# EAGLE design RoverWingPogoTester-V1 (EAGLE 9.5.2)
Assembly variants: LCSC, DIGIKEY
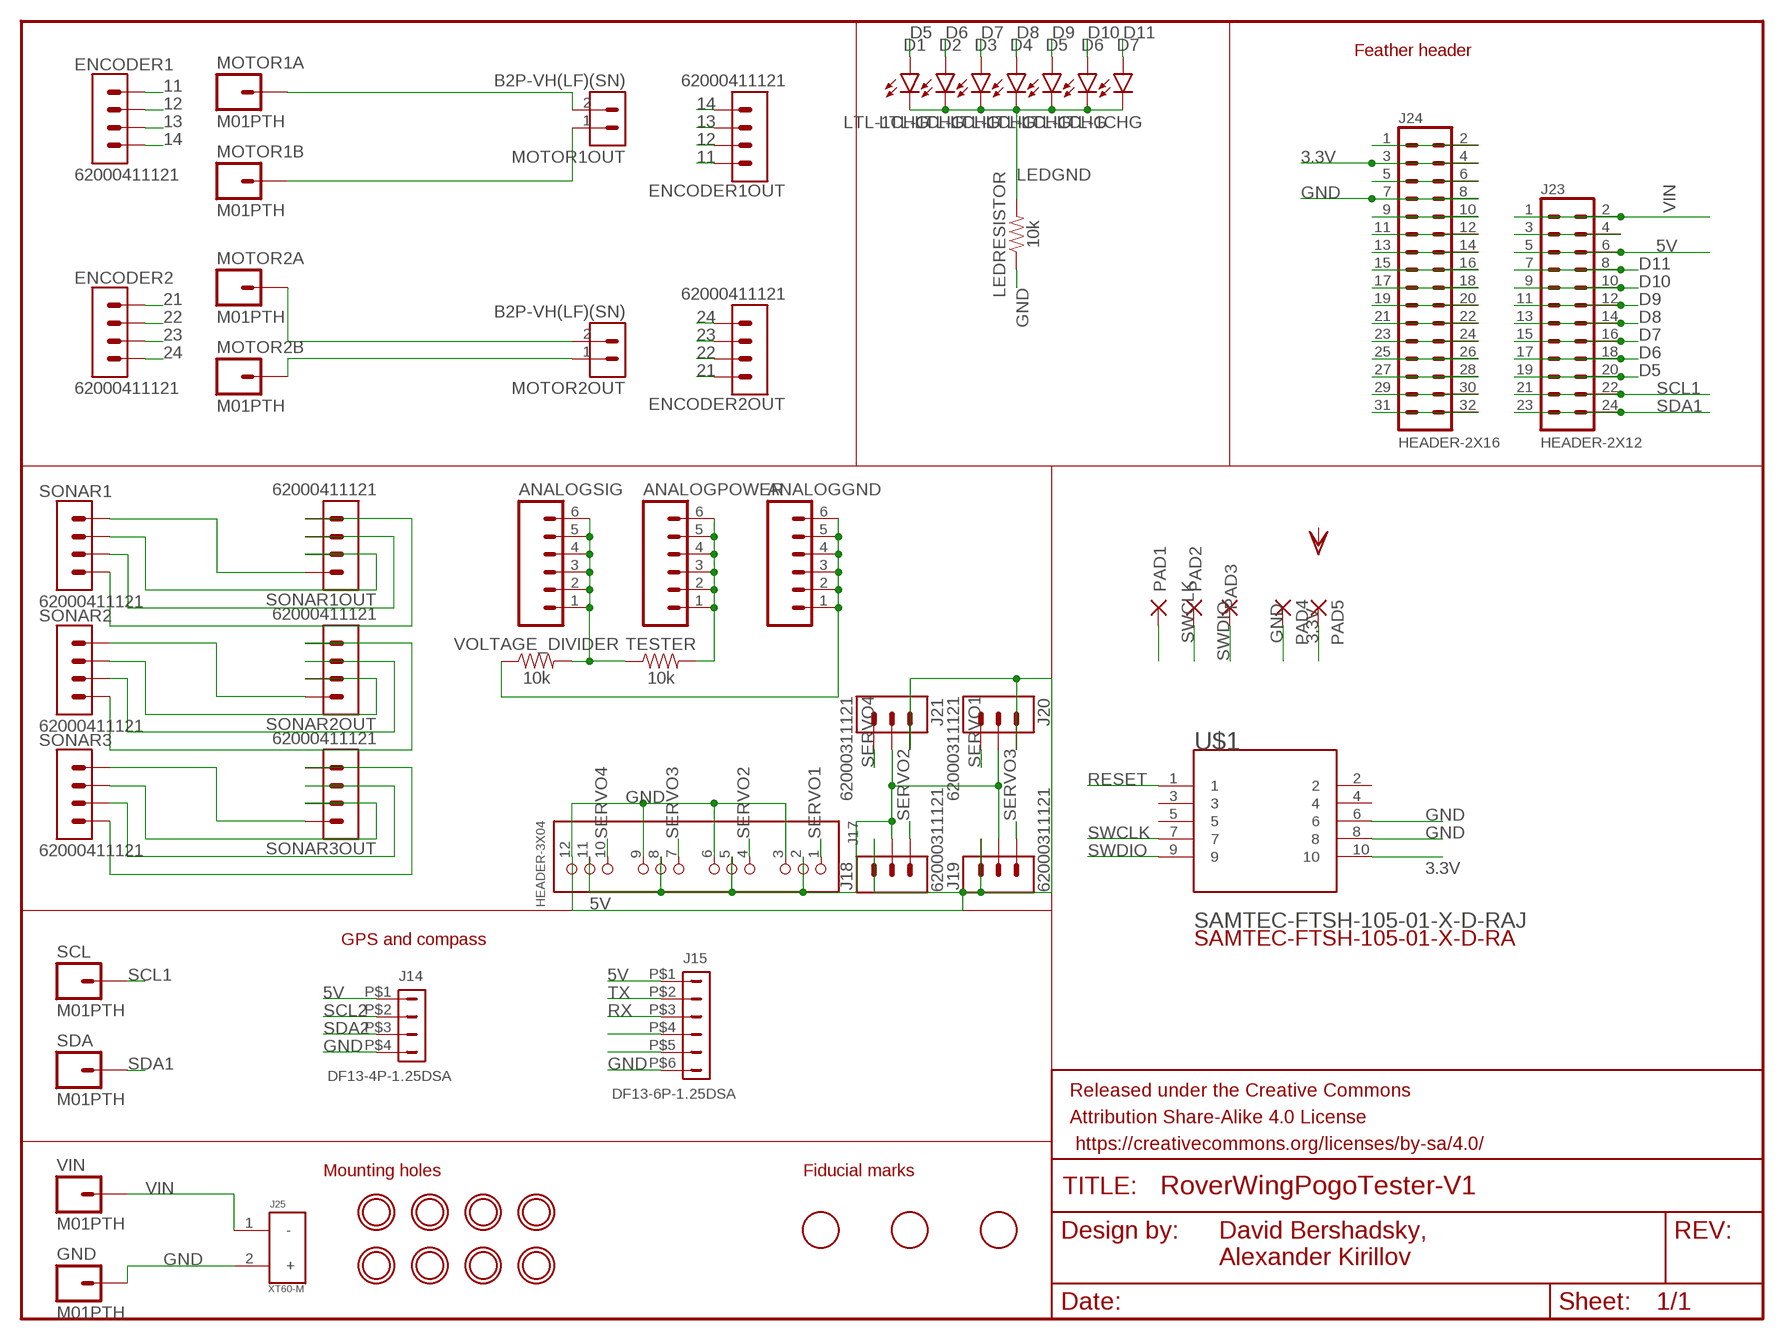
[diagram p0: schematic, sheet 1]

## Parts
ANALOGGND  M06SIP  [1X06]
ANALOGPOWER  M06SIP  [1X06]
ANALOGSIG  M06SIP  [1X06]
D1  LTL-1CHG  [RADIAL_3MM]
D2  LTL-1CHG  [RADIAL_3MM]
D3  LTL-1CHG  [RADIAL_3MM]
D4  LTL-1CHG  [RADIAL_3MM]
D5  LTL-1CHG  [RADIAL_3MM]
D6  LTL-1CHG  [RADIAL_3MM]
D7  LTL-1CHG  [RADIAL_3MM]
ENCODER1  62000411121  [62000411121]
ENCODER1OUT  62000411121  [62000411121]
ENCODER2  62000411121  [62000411121]
ENCODER2OUT  62000411121  [62000411121]
FRAME3  FRAME-LETTERNO_PACKAGE  [DUMMY]
GND  M01PTH  [1X01]
J14  DF13-4P-1.25DSA  [DF13-4P-1.25DSA]
J15  DF13-6P-1.25DSA  [DF13-6P-1.25DSA]
J17  HEADER-3X04  [3X04]
J18  62000311121  [62000311121]
J19  62000311121  [62000311121]
J20  62000311121  [62000311121]
J21  62000311121  [62000311121]
J23  HEADER-2X12  [2X12]
J24  HEADER-2X16  [2X16]
J25  XT60-M  [AMASS_XT60-M]
LEDRESISTOR  10k  10KOHM-HORIZ-1/4W-1%  [AXIAL-0.3]
MOTOR1A  M01PTH  [1X01]
MOTOR1B  M01PTH  [1X01]
MOTOR1OUT  B2P-VH(LF)(SN)  [HDR-02]
MOTOR2A  M01PTH  [1X01]
MOTOR2B  M01PTH  [1X01]
MOTOR2OUT  B2P-VH(LF)(SN)  [HDR-02]
PAD1  2,15/1,0  [2,15/1,0]
PAD2  2,15/1,0  [2,15/1,0]
PAD3  2,15/1,0  [2,15/1,0]
PAD4  2,15/1,0  [2,15/1,0]
PAD5  2,15/1,0  [2,15/1,0]
SCL  M01PTH  [1X01]
SDA  M01PTH  [1X01]
SONAR1  62000411121  [62000411121]
SONAR1OUT  62000411121  [62000411121]
SONAR2  62000411121  [62000411121]
SONAR2OUT  62000411121  [62000411121]
SONAR3  62000411121  [62000411121]
SONAR3OUT  62000411121  [62000411121]
TESTER  10k  10KOHM-HORIZ-1/4W-1%  [AXIAL-0.3]
U$1  SAMTEC-FTSH-105-01-X-D-RAJ  [SAMTEC-FTSH-105-01-X-D-RA]
U$3  MOUNTINGHOLE3.0_NPH  [MOUNTINGHOLE_3.0_NPH]
U$4  MOUNTINGHOLE3.0_NPH  [MOUNTINGHOLE_3.0_NPH]
U$11  FIDUCIAL  [FIDUCIAL_1MM]
U$13  FIDUCIAL  [FIDUCIAL_1MM]
U$14  MOUNTINGHOLE3.0_NPH  [MOUNTINGHOLE_3.0_NPH]
U$15  MOUNTINGHOLE3.0_NPH  [MOUNTINGHOLE_3.0_NPH]
U$17  FIDUCIAL  [FIDUCIAL_1MM]
U$24  MOUNTINGHOLE3.0_NPH  [MOUNTINGHOLE_3.0_NPH]
U$25  MOUNTINGHOLE3.0_NPH  [MOUNTINGHOLE_3.0_NPH]
U$26  MOUNTINGHOLE3.0_NPH  [MOUNTINGHOLE_3.0_NPH]
U$27  MOUNTINGHOLE3.0_NPH  [MOUNTINGHOLE_3.0_NPH]
VIN  M01PTH  [1X01]
VOLTAGE_DIVIDER  10k  10KOHM-HORIZ-1/4W-1%  [AXIAL-0.3]

## Nets
3.3V: J24.3 J24.4 PAD5.1(P) U$1.10
5V: J14.P$1 J15.P$1 J17.2 J17.5 J17.8 J17.11 J18.2 J19.2 J20.2 J21.2 J23.5 J23.6
11: ENCODER1.1 ENCODER1OUT.1
12: ENCODER1.2 ENCODER1OUT.2
13: ENCODER1.3 ENCODER1OUT.3
14: ENCODER1.4 ENCODER1OUT.4
21: ENCODER2.1 ENCODER2OUT.1
22: ENCODER2.2 ENCODER2OUT.2
23: ENCODER2.3 ENCODER2OUT.3
24: ENCODER2.4 ENCODER2OUT.4
!RESET1: J24.1 J24.2
D5: D1.A J23.19 J23.20
D6: D2.A J23.17 J23.18
D7: D3.A J23.15 J23.16
D8: D4.A J23.13 J23.14
D9: D5.A J23.11 J23.12
D10: D6.A J23.9 J23.10
D11: D7.A J23.7 J23.8
GND: GND.1 J14.P$4 J15.P$6 J17.3 J17.6 J17.9 J17.12 J18.1 J19.1 J20.1 J21.1 J24.7 J24.8 J25.2(+) LEDRESISTOR.P$1 PAD4.1(P) U$1.6 U$1.8
LEDGND: D1.C D2.C D3.C D4.C D5.C D6.C D7.C LEDRESISTOR.P$2
N$1: MOTOR1A.1 MOTOR1OUT.2
N$2: MOTOR1B.1 MOTOR1OUT.1
N$3: MOTOR2A.1 MOTOR2OUT.2
N$4: MOTOR2B.1 MOTOR2OUT.1
N$5: SONAR1.4 SONAR1OUT.4
N$6: SONAR1.3 SONAR1OUT.3
N$7: SONAR1.2 SONAR1OUT.2
N$8: ANALOGPOWER.1 ANALOGPOWER.2 ANALOGPOWER.3 ANALOGPOWER.4 ANALOGPOWER.5 ANALOGPOWER.6 TESTER.P$2
N$9: SONAR1.1 SONAR1OUT.1
N$10: SONAR2.4 SONAR2OUT.4
N$11: SONAR2.3 SONAR2OUT.3
N$12: SONAR2.2 SONAR2OUT.2
N$13: SONAR2.1 SONAR2OUT.1
N$14: SONAR3.4 SONAR3OUT.4
N$15: SONAR3.3 SONAR3OUT.3
N$16: SONAR3.2 SONAR3OUT.2
N$17: SONAR3.1 SONAR3OUT.1
N$18: ANALOGSIG.1 ANALOGSIG.2 ANALOGSIG.3 ANALOGSIG.4 ANALOGSIG.5 ANALOGSIG.6 TESTER.P$1 VOLTAGE_DIVIDER.P$2
N$23: ANALOGGND.1 ANALOGGND.2 ANALOGGND.3 ANALOGGND.4 ANALOGGND.5 ANALOGGND.6 VOLTAGE_DIVIDER.P$1
N$24: J23.3 J23.4
N$26: J15.P$4
N$27: J15.P$5
N$34: J24.5 J24.6
N$35: J24.9 J24.10
N$36: J24.11 J24.12
N$37: J24.13 J24.14
N$38: J24.15 J24.16
N$39: J24.17 J24.18
N$47: J24.19 J24.20
N$60: J24.21 J24.22
N$61: J24.23 J24.24
N$62: J24.25 J24.26
N$63: J24.27 J24.28
N$64: J24.29 J24.30
N$65: J24.31 J24.32
RESET: PAD1.1(P) U$1.1
RX: J15.P$3
SCL1: J23.21 J23.22 SCL.1
SCL2: J14.P$2
SDA1: J23.23 J23.24 SDA.1
SDA2: J14.P$3
SERVO1: J17.1 J20.3
SERVO2: J17.4 J18.3
SERVO3: J17.7 J19.3
SERVO4: J17.10 J21.3
SWCLK: PAD2.1(P) U$1.7
SWDIO: PAD3.1(P) U$1.9
TX: J15.P$2
VIN: J23.1 J23.2 J25.1(-) VIN.1
Unconnected: U$1.2 U$1.3 U$1.4 U$1.5

## Notes on the sheet
- Feather header
- GPS and compass
- Mounting holes | Fiducial marks
- David Bershadsky, 
  Alexander Kirillov

## Library data of the parts
ANALOGGND ANALOGPOWER ANALOGSIG = SparkFun:M06: Header 6 Standard 6-pin 0.1" header. Use with straight break away headers (SKU : PRT-00116), right angle break away headers (PRT-00553), swiss pins (PRT-00743), machine pins (PRT-00117), and female headers (PRT-00115). Molex polarized connector foot print use with SKU : PRT-08094 with associated crimp pins and housings. NOTES ON THE VARIANTS LOCK and LOCK_LONGPADS... This footprint was designed to help hold the alignment of a through-hole component (i.e. 6-pin header) while soldering it into place. You may notice that each hole has been shifted either up or down by 0.005 of an inch from it's more standard position (which is a perfectly straight line). This slight alteration caused the pins (the squares in the middle) to touch the edges of the holes. Because they are alternating, it causes a "brace" to hold the component in place. 0.005 has proven to be the perfect amount of "off-center" position when using our standard breakaway headers. Although looks a little odd when you look at the bare footprint, once you have a header in there, the alteration is very hard to notice. Also, if you push a header all the way into place, it is covered up entirely on the bottom side. This idea of altering the position of holes to aid alignment will be further integrated into the Sparkfun Library for other footprints. It can help hold any component with 3 or more connection pins.
D1-D7 = LED:LTL-1CHG: LED RED DIFFUSED T/H Manufacturer's datasheet <https://media.digikey.com/pdf/Data%20Sheets/Lite-On%20PDFs/LTL-1CHG.pdf>; CREATED_BY: PCBLayout.com; DIGIKEY_PART_NUMBER: 160-1710-ND; MANUFACTURER: Lite-On Inc.; MPN: LTL-1CHG; PACKAGE: RADIAL 3MM
ENCODER1 ENCODER1OUT ENCODER2 ENCODER2OUT SONAR1 SONAR1OUT SONAR2 SONAR2OUT SONAR3 SONAR3OUT = Headers:62000411121: THT Vertical Pin Header WR-PHD, Pitch 2.00 mm, Single Row, 4 pins Manufacturer's datasheet <https://datasheet.octopart.com/62000411121-W%C3%BCrth-Elektronik-datasheet-117282003.pdf>; CREATED_BY: PCBLayout.com; MANUFACTURER: Würth Elektronik; MPN: 62000411121
FRAME3 = RoverWing-V1.5:FRAME-LETTER: Schematic Frame - Letter Standard 8.5x11 US Letter frame; BOM: EXCLUDE
GND MOTOR1A MOTOR1B MOTOR2A MOTOR2B SCL SDA VIN = SparkFun:M01: Header 1 Standard 1-pin 0.1" header. Use with straight break away headers (SKU : PRT-00116), right angle break away headers (PRT-00553), swiss pins (PRT-00743), machine pins (PRT-00117), and female headers (PRT-00115).
J14 = RoverWing-V1.5:DF13-4P-1.25: DF13-4P 1.25mm Pitch Miniature Crimping Connector.; MANUFACTURER: Hirose; PARTNO: DF13-4P-1.25DSA
J15 = RoverWing-V1.5:DF13-6P-1.25: DF13-6P 1.25mm Pitch Miniature Crimping Connector.; MANUFACTURER: Hirose; PARTNO: DF13-6P-1.25DSA
J17 = RoverWing-V1.5:HEADER-3X04
J18-J21 = Headers:62000311121: THT Vertical Pin Header WR-PHD, Pitch 2.00 mm, Single Row, 3 pins Manufacturer's datasheet <https://datasheet.octopart.com/62000311121-W%C3%BCrth-Elektronik-datasheet-117282002.pdf>; CREATED_BY: PCBLayout.com; MANUFACTURER: Würth Elektronik; MPN: 62000311121
J23 = RoverWing-V1.5:HEADER-2X12: HEADER, 2x12, 0.1" PITCH; MANUFACTURER: CONNFLY Elec; PARTNO: DS1023-2*12SF11
J24 = RoverWing-V1.5:HEADER-2X16: HEADER - 2x16, 0.1" PITCH; MANUFACTURER: CONNFLY Elec; PARTNO: DS1023-2*16SF11
J25 = XT60-M:XT60-M: DC supply; XT60; male; PIN:2; for cable; soldered; 60A; 500V; AVAILABILITY: Unavailable; MF: AMASS; MP: XT60-M; PACKAGE: Package Analog Devices; PRICE: None
LEDRESISTOR TESTER VOLTAGE_DIVIDER = SparkFun-Resistors:10KOHM: 10kΩ resistor A resistor is a passive two-terminal electrical component that implements electrical resistance as a circuit element. Resistors act to reduce current flow, and, at the same time, act to lower voltage levels within circuits. - Wikipedia; PROD_ID: RES-12183
MOTOR1OUT MOTOR2OUT = Connectors:B2P-VH(LF)(SN): CONN HEADER VERT 2POS 3.96MM Manufacturer's datasheet <http://www.jst-mfg.com/product/pdf/eng/eVH.pdf>; CREATED_BY: PCBLayout.com; DIGIKEY_PART_NUMBER: 455-1639-ND; MANUFACTURER: JST Sales America Inc.; MPN: B2P-VH(LF)(SN)
PAD1-PAD5 = wirepad:2,15/1,0: THROUGH-HOLE PAD
U$1 = SAMTEC-FTSH-105-01-X-D-RA:SAMTEC-FTSH-105-01-X-D-RA; DESCRIPTION: Conn Unshrouded Header HDR 10 POS 1.27mm Solder RA Thru-Hole Tube; DIGI-KEY_PART_NUMBER: SAM9432-ND; DIGI-KEY_PURCHASE_URL: https://www.digikey.com/product-detail/en/samtec-inc/FTSH-105-01-F-D-RA-K/SAM9432-ND/6678169?utm_source=snapeda&utm_medium=aggregator&utm_campaign=symbol; MF: Samtec Inc.; MP: FTSH-105-01-F-D-RA-K; PACKAGE: None
U$3 U$4 U$14 U$15 U$24-U$27 = RoverWing-V1.5:MOUNTINGHOLE: Mounting Hole For #2 screws (0.086"/2.18mm width, 0.094"/2.4mm hole) use 2.5mm; BOM: EXCLUDE
U$11 U$13 U$17 = RoverWing-V1.5:FIDUCIAL: For use by pick and place machines to calibrate the vision/machine, 1mm By microbuilder.eu; BOM: EXCLUDE

## Net classes
1 thinpower: width 0.305 mm
2 thickpower: width 0.406 mm

## Board
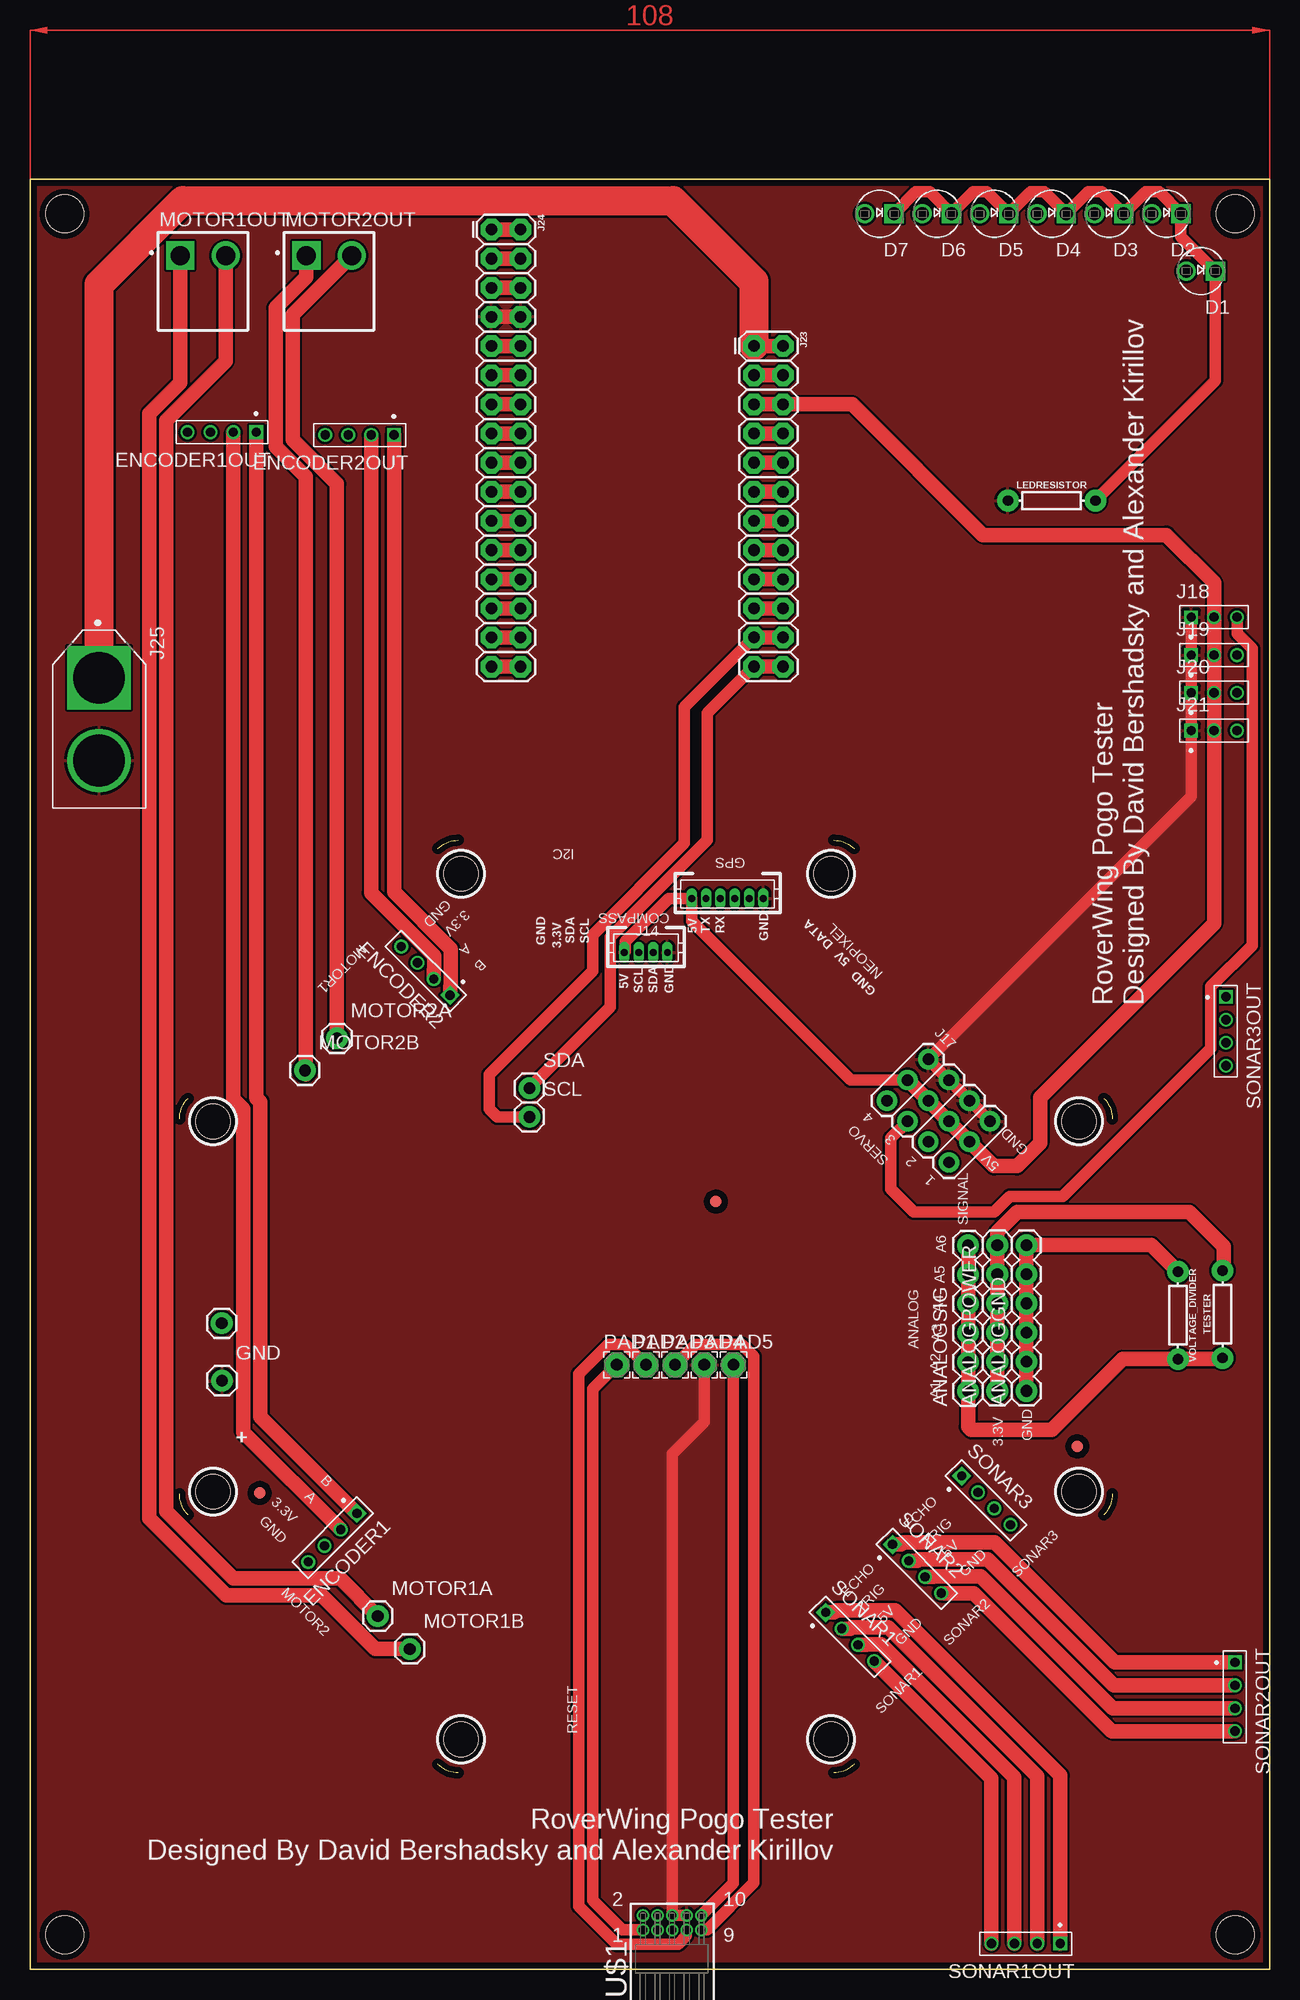
[diagram p1: board, top side]
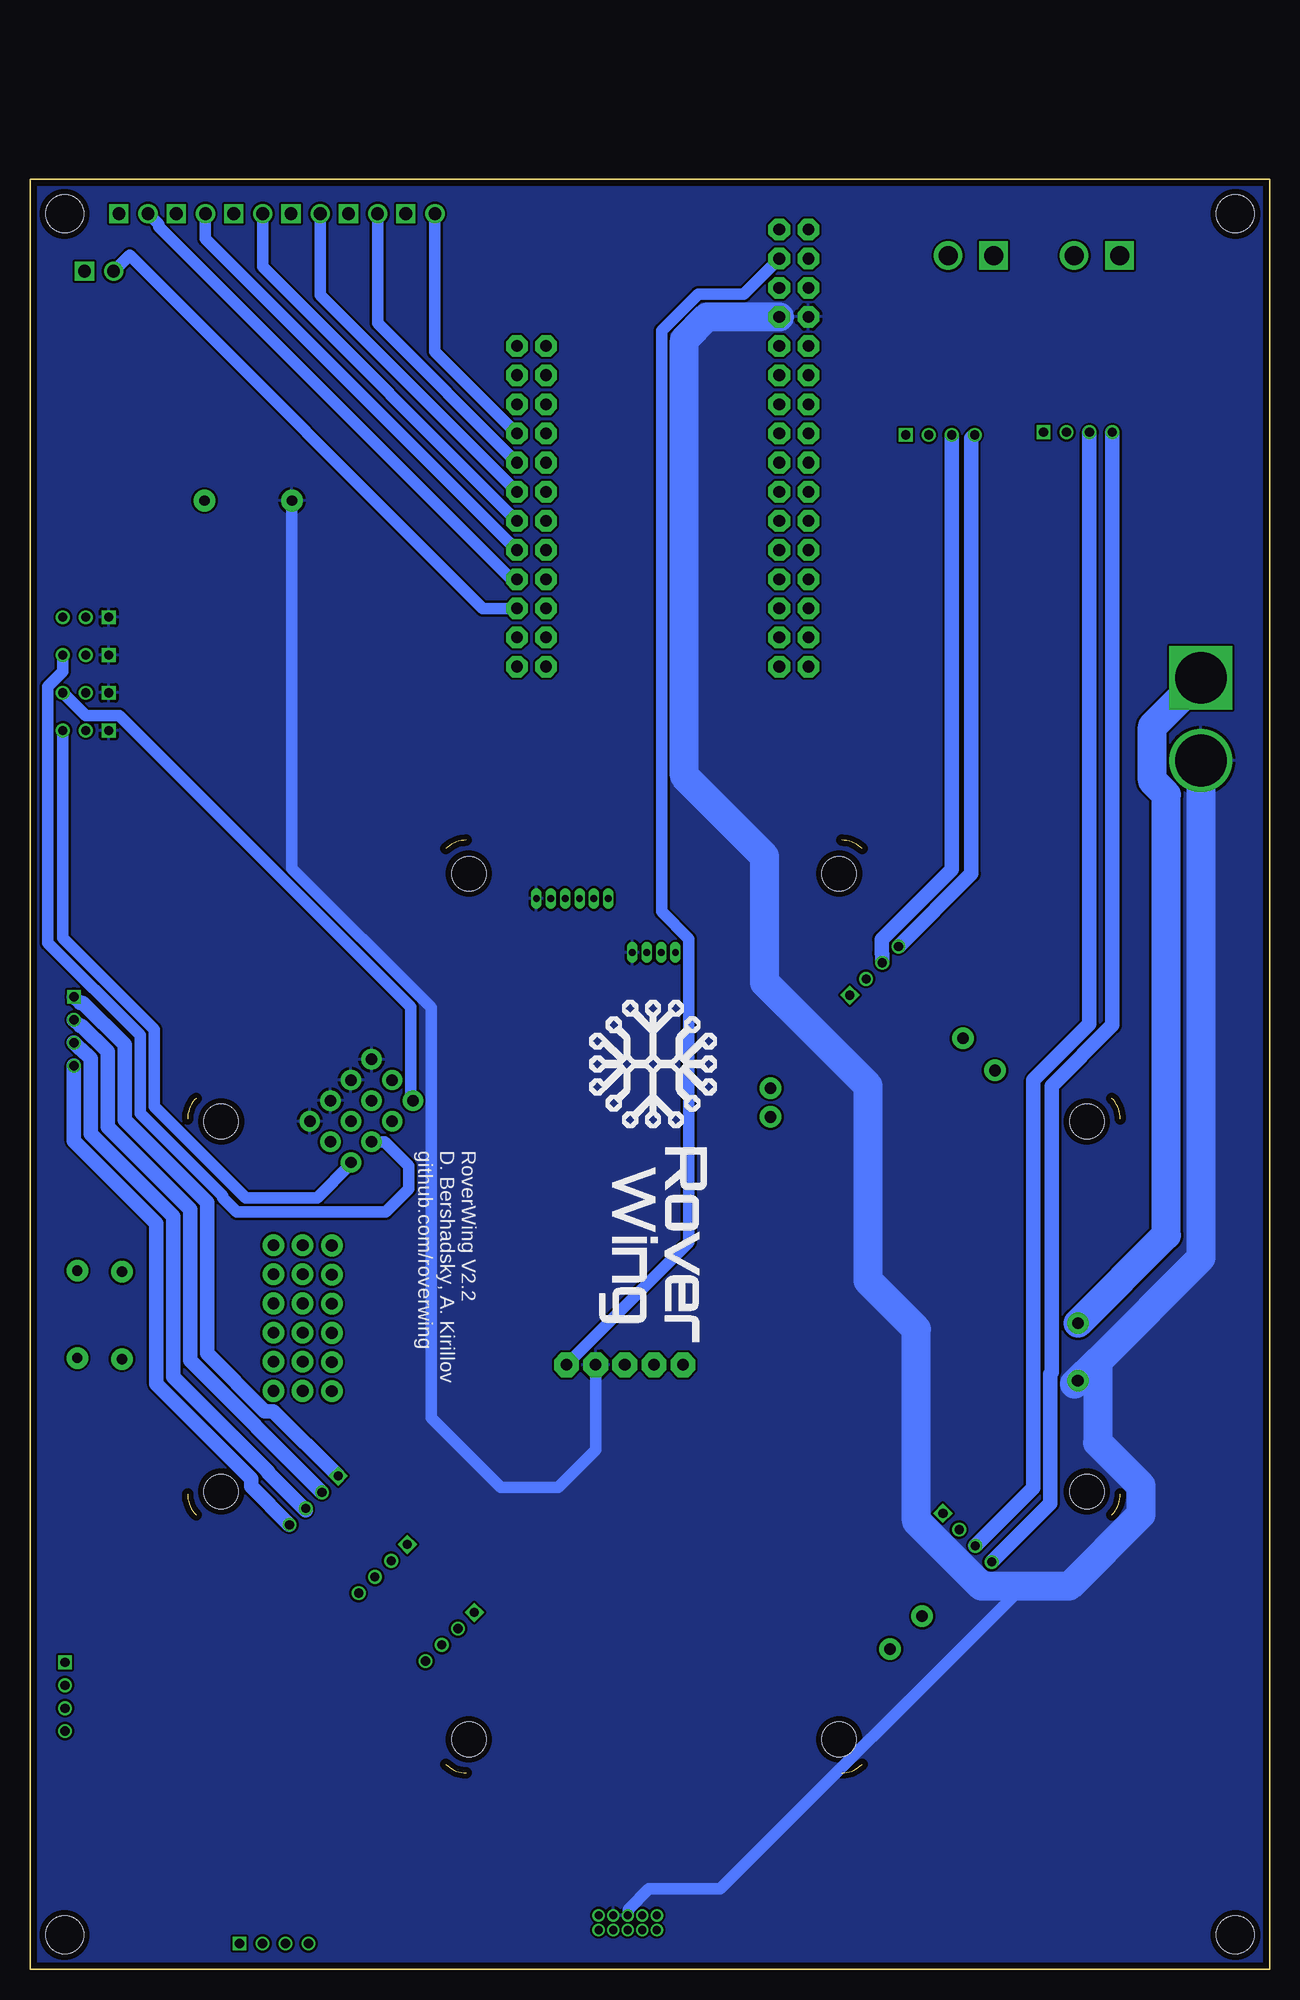
[diagram p2: board, bottom side, seen from below]

Size 108 x 156 mm. Coordinates in mm from the lower left corner, seen from the top.
Outline: 13.01,74.11 arc-45 13.76,75.91
Outline: 35.51,97.66 arc-45 37.3,98.41
Outline: 70,98.41 arc-45 71.79,97.66
Outline: 93.55,75.91 arc-45 94.29,74.11
Outline: 94.29,41.42 arc-45 93.55,39.62
Outline: 71.79,17.87 arc-45 70,17.12
Outline: 37.3,17.12 arc-45 35.51,17.87
Outline: 13.76,39.62 arc-45 13.01,41.42
Outline: 0,156 108,156 108,0 0,0 0,156
Copper layers (1*16): Top 0.035mm / dielectric 1.6mm / Bottom 0.035mm
Design rules "Elecrow_2-layer_PCB_eagle_rule *": minimum track width 6mil, minimum drill 12mil, track to track 8mil, track to pad 8mil, pad to pad 8mil, via to via 8mil, smd to smd 0mil, copper to edge 20mil, drill to drill 10mil, minimum pad ring 6mil, minimum via ring 6mil, stop-mask expansion 0mil, vias tented up to drill 100mil, thermal gap 10mil
Holes 3.3 mm at 3,153 3,3 105,3 105,153

### Footprints (pad centres in the part's own frame; a part is rotated, then mirrored left to right if it is on the bottom)
1X06 = drill 1.016 pad 1.88: 1 0,0; 2 2.54,0; 3 5.08,0; 4 7.62,0; 5 10.16,0; 6 12.7,0
RADIAL_3MM = drill 1.11 pad 1.67: A 1.27,0 | drill 1.11 pad 1.67 square: C -1.27,0
62000411121 = drill 0.8 square: 1 -3,0 | drill 0.8: 2 -1,0; 3 1,0; 4 3,0
1X01 = drill 1.016 pad 1.88: 1 0,0
DF13-4P-1.25DSA = drill 0.6 pad 0.8 long: P$1 1.875,0; P$2 0.625,0; P$3 -0.625,0; P$4 -1.875,0
DF13-6P-1.25DSA = drill 0.6 pad 0.9 long: P$1 3.125,0; P$2 1.875,0; P$3 0.625,0; P$4 -0.625,0; P$5 -1.875,0; P$6 -3.125,0
3X04 = drill 1 pad 1.778: 1 -3.81,-2.54; 2 -3.81,0; 3 -3.81,2.54; 4 -1.27,-2.54; 5 -1.27,0; 6 -1.27,2.54; 7 1.27,-2.54; 8 1.27,0; 9 1.27,2.54; 10 3.81,-2.54; 11 3.81,0; 12 3.81,2.54
62000311121 = drill 0.8 square: 1 -2,0 | drill 0.8: 2 0,0; 3 2,0
2X12 = drill 1.016 pad 1.88 octagon: 1 0,0; 2 0,2.54; 3 2.54,0; 4 2.54,2.54; 5 5.08,0; 6 5.08,2.54; 7 7.62,0; 8 7.62,2.54; 9 10.16,0; 10 10.16,2.54; 11 12.7,0; 12 12.7,2.54; 13 15.24,0; 14 15.24,2.54; 15 17.78,0; 16 17.78,2.54; 17 20.32,0; 18 20.32,2.54; 19 22.86,0; 20 22.86,2.54; 21 25.4,0; 22 25.4,2.54; 23 27.94,0; 24 27.94,2.54
2X16 = drill 1.016 pad 1.88 octagon: 1 0,0; 2 0,2.54; 3 2.54,0; 4 2.54,2.54; 5 5.08,0; 6 5.08,2.54; 7 7.62,0; 8 7.62,2.54; 9 10.16,0; 10 10.16,2.54; 11 12.7,0; 12 12.7,2.54; 13 15.24,0; 14 15.24,2.54; 15 17.78,0; 16 17.78,2.54; 17 20.32,0; 18 20.32,2.54; 19 22.86,0; 20 22.86,2.54; 21 25.4,0; 22 25.4,2.54; 23 27.94,0; 24 27.94,2.54; 25 30.48,0; 26 30.48,2.54; 27 33.02,0; 28 33.02,2.54; 29 35.56,0; 30 35.56,2.54; 31 38.1,0; 32 38.1,2.54
AMASS_XT60-M = drill 4.5 square: 1 -3.6,0 | drill 4.5: 2 3.6,0
AXIAL-0.3 = drill 0.9 pad 1.88: P$1 -3.81,0; P$2 3.81,0
HDR-02 = drill 1.65 square: 1 -1.98,0 | drill 1.65: 2 1.98,0
2,15/1,0 = drill 1.016 pad 2.159 octagon: 1 0,0
SAMTEC-FTSH-105-01-X-D-RA = drill 0.71 pad 0.762: 1 -2.54,2.527 | drill 0.71 pad 1.067: 2 -2.54,3.797; 3 -1.27,2.527; 4 -1.27,3.797; 5 0,2.527; 6 0,3.797; 7 1.27,2.527; 8 1.27,3.797; 9 2.54,2.527; 10 2.54,3.797
MOUNTINGHOLE_3.0_NPH = hole 3: 0,0
FIDUCIAL_1MM = smd 1 x 1: 1 0,0

### Placement (x,y rotation side)
ANALOGGND  86.8,50.41 90 top
ANALOGPOWER  84.26,50.41 90 top
ANALOGSIG  81.72,50.39 90 top
D1  102,148 180 top
D2  99,153 180 top
D3  94,153 180 top
D4  89,153 180 top
D5  84,153 180 top
D6  79,153 180 top
D7  74,153 180 top
ENCODER1  26.35,37.62 225 top
ENCODER1OUT  16.71,133.96 180 top
ENCODER2  34.46,87.02 135 top
ENCODER2OUT  28.71,133.72 180 top
FRAME3  5.39,11.35 0 top
GND  16.72,51.3 0 top
J14  53.65,88.63 180 top
J15  60.76,93.33 180 top
J17  79.15,74.81 315 top
J18  103.15,117.84 0 top
J19  103.15,114.55 0 top
J20  103.15,111.26 0 top
J21  103.15,107.97 0 top
J23  63.05,141.47 270 top
J24  40.19,151.63 270 top
J25  6,108.95 270 top
LEDRESISTOR  89,128 0 top
MOTOR1A  30.28,30.78 0 top
MOTOR1B  33.08,27.92 0 top
MOTOR1OUT  15.06,149.36 0 top
MOTOR2A  26.73,81.13 0 top
MOTOR2B  23.93,78.34 0 top
MOTOR2OUT  26.04,149.36 0 top
PAD1  51.11,52.69 0 top
PAD2  53.65,52.69 0 top
PAD3  56.19,52.69 0 top
PAD4  58.73,52.69 0 top
PAD5  61.27,52.69 0 top
SCL  43.49,74.29 0 top
SDA  43.49,76.8 0 top
SONAR1  71.43,28.98 315 top
SONAR1OUT  86.76,2.24 180 top
SONAR2  77.26,34.9 315 top
SONAR2OUT  104.97,23.76 270 top
SONAR3  83.29,40.87 315 top
SONAR3OUT  104.18,81.76 270 top
TESTER  103.89,57.09 90 top
U$1  55.93,0.9 0 top
U$3  37.52,20.05 0 top
U$4  69.78,20.05 0 top
U$11  91.24,45.57 0 top
U$13  20,41.51 0 top
U$14  15.93,41.64 0 top
U$15  15.93,73.89 0 top
U$17  59.75,66.91 0 top
U$24  91.37,41.64 0 top
U$25  91.37,73.89 0 top
U$26  37.52,95.48 0 top
U$27  69.78,95.48 0 top
VIN  16.69,56.31 0 top
VOLTAGE_DIVIDER  100,57 270 top

### Tracks (layer width: path | path; a pad name or v marks a point on that pad's centre or on a via)
3.3V
  Top 1.016: U$1.10 61.27,7.49 PAD5.1
  Top 1.27: J24.3 J24.4
  Bottom 1.016: J24.4 45.83,145.99 49.81,145.99 52.98,142.82 52.98,92.18 50.61,89.81 50.61,63.34 PAD5.1
5V
  Top 1.016: J14.P$1 51.86,88.71 51.86,89.56 55.63,93.33 J15.P$1 57.64,91.36 71.5,77.5 J17.2
  Top 1.27: J23.5 J23.6 71.61,136.39 83,125 99,125 103.15,120.85 J18.2 J19.2 J20.2 J21.2 103.15,91.15 88,76 88,72 86,70 83.96,70 J17.11 J17.8 J17.5 J17.2
11
  Top 1.27: ENCODER1OUT.1 19.71,75.94 20.05,75.6 20.05,48.17 ENCODER1.1
12
  Top 1.27: ENCODER1OUT.2 17.71,75.86 18.58,74.99 18.58,46.81 ENCODER1.2
13
  Bottom 1.27: ENCODER1.3 20.58,41.97 20.58,77.5 15.71,82.38 ENCODER1OUT.3
14
  Bottom 1.27: ENCODER1OUT.4 13.71,82.29 19,77 19,52 19.11,51.89 19.11,40.62 ENCODER1.4
21
  Top 1.27: ENCODER2OUT.1 31.71,93.89 36.66,88.93 36.66,85.73 36.58,85.64 ENCODER2.1
22
  Top 1.27: ENCODER2.2 35.17,87.11 35.19,87.13 35.19,88.32 29.71,93.81 ENCODER2OUT.2
23
  Bottom 1.27: ENCODER2OUT.3 27.71,95.86 33.81,89.75 33.81,88.53 33.75,88.47 ENCODER2.3
24
  Bottom 1.27: ENCODER2.4 26,95.48 26,133.43 ENCODER2OUT.4
!RESET1
  Top 1.27: J24.1 J24.2
D5
  Top 1.27: J23.20 J23.19
  Bottom 1.016: D1.A 99.34,149.39 68.56,118.61 J23.20
D6
  Top 1.27: J23.18 J23.17
  Bottom 1.016: D2.A 96.82,152.09 96.82,151.87 66.1,121.15 J23.18
D7
  Top 1.27: J23.16 J23.15
  Bottom 1.016: J23.16 92.73,150.83 D3.A
D8
  Top 1.27: J23.14 J23.13
  Bottom 1.016: J23.14 87.73,148.37 D4.A
D9
  Top 1.27: J23.12 J23.11
  Bottom 1.016: J23.12 82.73,145.91 D5.A
D10
  Top 1.27: J23.10 J23.9
  Bottom 1.016: J23.10 77.73,143.45 D6.A
D11
  Top 1.27: J23.7 J23.8
  Bottom 1.016: D7.A 72.73,140.99 J23.8
GND
  Top 1.016: J17.12 J17.9 | J17.9 | J17.9 J17.6 J17.3 | J17.3 | J17.3 101.15,102.2 J21.1 J20.1 J19.1 J18.1 | U$1.8 U$1.6 55.93,44.93 58.73,47.73 PAD4.1
  Top 1.27: J24.7 42.99,144.01 43,144
  Bottom 1.016: LEDRESISTOR.P$1 85.19,95.94 73.06,83.8 73.06,48.06 67,42 62,42 58.73,45.27 PAD4.1 | U$1.6 55.91,4.72 55.91,5.21 54.12,7 47.86,7 21.47,33.39
  Bottom 2.54: J25.2 6,62 15,53 | 15,53 17,51 17,51.02 GND.1 | 15,53 15,45.92 11.23,42.16 11.23,39.63 17.47,33.39 21.47,33.39 25.1,33.39 30.79,39.08 30.79,55.79 35,60 35,77 44,86 44,97 51,104 51,142 48.99,144.01 J24.8
  pour Top: 0,156 0,0 108,0 108,156
  pour Bottom: 0,156 0,0 108,0 108,156
LEDGND
  Top 1.016: D7.C 77.18,154.91 78.36,154.91 D6.C 82.18,154.91 83.36,154.91 D5.C 87.18,154.91 88.36,154.91 D4.C 92.18,154.91 93.36,154.91 D3.C 97.18,154.91 98.36,154.91 D2.C 100.27,151 D1.C 103.27,138.46 LEDRESISTOR.P$2
N$1
  Top 1.27: MOTOR1A.1 27,34.06 17.7,34.06 11.86,39.91 11.86,134.99 17.04,140.17 MOTOR1OUT.2
N$2
  Top 1.27: MOTOR1OUT.1 13.08,138.29 10.38,135.6 10.38,39.3 17.09,32.59 25.41,32.59 30.08,27.92 MOTOR1B.1
N$3
  Top 1.27: MOTOR2A.1 26.73,129.46 22.86,133.33 22.86,144.19 MOTOR2OUT.2
N$4
  Top 1.27: MOTOR2OUT.1 24.06,147.48 21.38,144.81 21.38,132.72 24,130.1 24,78 23.93,78.07 MOTOR2B.1
N$5
  Top 1.27: SONAR1.4 83.76,16.65 SONAR1OUT.4
N$6
  Top 1.27: SONAR1.3 72.88,28.27 72.94,28.33 74.16,28.33 85.76,16.74 SONAR1OUT.3
N$7
  Top 1.27: SONAR1.2 71.47,29.69 71.58,29.81 74.77,29.81 87.76,16.82 SONAR1OUT.2
N$8
  Top 1.27: ANALOGPOWER.1 ANALOGPOWER.2 ANALOGPOWER.3 ANALOGPOWER.4 ANALOGPOWER.5 ANALOGPOWER.6 84.26,64.26 86,66 101,66 104,63 104,61.01 TESTER.P$2
N$9
  Top 1.27: SONAR1.1 70.05,31.1 70.23,31.28 75.38,31.28 89.76,16.9 SONAR1OUT.1
N$10
  Top 1.27: SONAR2.4 82.22,32.78 94.24,20.76 SONAR2OUT.4
N$11
  Top 1.27: SONAR2OUT.3 94.33,22.76 82.83,34.25 78.77,34.25 78.71,34.2 SONAR2.3
N$12
  Top 1.27: SONAR2OUT.2 94.41,24.76 83.44,35.73 77.41,35.73 77.3,35.61 SONAR2.2
N$13
  Top 1.27: SONAR2OUT.1 94.49,26.76 84.05,37.2 76.06,37.2 75.88,37.02 SONAR2.1
N$14
  Bottom 1.27: SONAR3.4 88.73,42.07 88.73,42.73 97,51 97,65 104.19,72.19 SONAR3OUT.4
N$15
  Bottom 1.27: SONAR3OUT.3 103.66,80.23 103.57,80.23 102.71,79.37 102.71,72.8 95.53,65.61 95.53,51.61 87.25,43.34 87.25,43.25 84,40 83.99,40.01 SONAR3.3
N$16
  Bottom 1.27: SONAR3.2 94.05,53.05 94.05,66.22 101.24,73.41 101.24,79.98 103.49,82.23 103.66,82.23 SONAR3OUT.2
N$17
  Bottom 1.27: SONAR3.1 86.81,48.63 87.55,48.63 92.58,53.66 92.58,66.83 99.77,74.02 99.77,80.59 103.41,84.23 103.66,84.23 SONAR3OUT.1
N$18
  Top 1.27: TESTER.P$1 103.8,53.19 VOLTAGE_DIVIDER.P$2 95.19,53.19 89,47 82,47 81.72,47.28 ANALOGSIG.1 ANALOGSIG.2 ANALOGSIG.3 ANALOGSIG.4 ANALOGSIG.5 ANALOGSIG.6
N$23
  Top 1.27: ANALOGGND.1 ANALOGGND.2 ANALOGGND.3 ANALOGGND.4 ANALOGGND.5 ANALOGGND.6 97.7,63.11 VOLTAGE_DIVIDER.P$1
N$24
  Top 1.27: J23.4 J23.3
N$34
  Top 1.27: J24.5 J24.6
N$35
  Top 1.27: J24.9 J24.10
N$36
  Top 1.27: J24.12 J24.11
N$37
  Top 1.27: J24.13 J24.14
N$38
  Top 1.27: J24.16 J24.15
N$39
  Top 1.27: J24.17 J24.18
N$47
  Top 1.27: J24.19 J24.20
N$60
  Top 1.27: J24.21 J24.22
N$61
  Top 1.27: J24.23 J24.24
N$62
  Top 1.27: J24.25 J24.26
N$63
  Top 1.27: J24.27 J24.28
N$64
  Top 1.27: J24.29 J24.30
N$65
  Top 1.27: J24.31 J24.32
RESET
  Top 1.016: U$1.1 51.57,3.43 49,6 49,50.58 PAD1.1
SCL1
  Top 1.016: J23.21 57,110.02 57,98.15 49,90.15 49,87 40,78 40,75 40.71,74.29 SCL.1
  Top 1.27: J23.22 J23.21
SDA1
  Top 1.016: SDA.1 50.56,83.87 50.56,89.98 59,98.42 59,109.48 J23.23
  Top 1.27: J23.24 J23.23
SERVO1
  Bottom 1.016: J17.1 74.86,75.9 74.86,83.88 100.26,109.28 103.17,109.28 J20.3
SERVO2
  Top 1.016: J18.3 105.15,116.4 106.46,115.09 106.46,89.24 102.87,85.65 102.87,80.26 89.96,67.35 85.35,67.35 84,66 77,66 75,68 75,72.46 J17.4
SERVO3
  Bottom 1.016: J19.3 105.15,113.11 106.46,111.8 106.46,89.46 98.42,81.42 98.42,74.57 91.23,67.39 91.23,67.23 90,66 77,66 75,68 75,70 77.12,72.12 J17.7
SERVO4
  Bottom 1.016: J21.3 105.15,89.88 97.2,81.92 97.2,75.2 89.22,67.22 83,67.22 80.05,70.17 J17.10
SWCLK
  Top 1.016: U$1.7 57.18,3.4 57.18,2.91 56.45,2.18 51.09,2.18 47.78,5.5 47.78,51.89 50.37,54.48 51.85,54.48 PAD2.1
SWDIO
  Top 1.016: U$1.9 58.5,3.45 58.99,3.45 63.06,7.52 63.06,53.43 62.01,54.48 57.99,54.48 PAD3.1
VIN
  Top 1.27: J23.2 J23.1
  Top 2.54: J25.1 6,146.84 13.3,154.15 56,154.15 63.05,147.09 J23.1
  Bottom 2.54: VIN.1 9,64 9,102.36 10.23,103.59 10.23,108.32 J25.1
(copper drawn outside any net)
  shapes: Top area x2

### Text on the board
tNames: I2C | GPS | GND | 3.3V | COMPASS | 5V | TX | RX | GND | MOTOR1 | A | GND | 3.3V | SDA | SCL | DATA | B | 5V | NEOPIXEL | 5V | SCL | SDA | GND | GND | RoverWing Pogo Tester / Designed By David Bershadsky and Alexander Kirillov | 4 | 3 | SERVO | GND | 2 | 5V | 1 | SIGNAL | A6 | A5 | A4 | A3 | ANALOG | A2 | A1 | + | 3.3V | GND | B | 3.3V | A | GND | ECHO | TRIG | 5V | GND | SONAR3 | MOTOR2 | ECHO | TRIG | 5V | GND | SONAR2 | SONAR1 | RESET | RoverWing Pogo Tester / Designed By David Bershadsky and Alexander Kirillov
bNames: RoverWing V2.2 / D. Bershadsky, A. Kirillov / github.com/roverwing